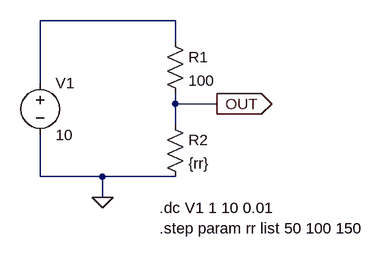
[diagram p0: schematic Analysis of the resistive voltage divider.asc]
Analysis of the resistive voltage divider.asc, the LTspice schematic file:
Version 4
SHEET 1 880 680
WIRE -384 -208 -592 -208
WIRE -384 -176 -384 -208
WIRE -592 -112 -592 -208
WIRE -384 -80 -384 -96
WIRE -320 -80 -384 -80
WIRE -384 -48 -384 -80
WIRE -592 32 -592 -32
WIRE -496 32 -592 32
WIRE -384 32 -496 32
WIRE -496 64 -496 32
FLAG -496 64 0
FLAG -320 -80 OUT
IOPIN -320 -80 Out
SYMBOL res -400 -192 R0
SYMATTR InstName R1
SYMATTR Value 100
SYMBOL res -400 -64 R0
SYMATTR InstName R2
SYMATTR Value {rr}
SYMBOL voltage -592 -128 R0
WINDOW 123 0 0 Left 0
WINDOW 39 0 0 Left 0
SYMATTR InstName V1
SYMATTR Value 10
TEXT -408 80 Left 2 !.dc V1 1 10 0.01
TEXT -408 112 Left 2 !.step param rr list 50 100 150

The netlist it stands for:
* Analysis of the resistive voltage divider.asc
R1 N001 OUT 100
R2 OUT 0 {rr}
V1 N001 0 10
.dc V1 1 10 0.01
.step param rr list 50 100 150
.backanno
.end